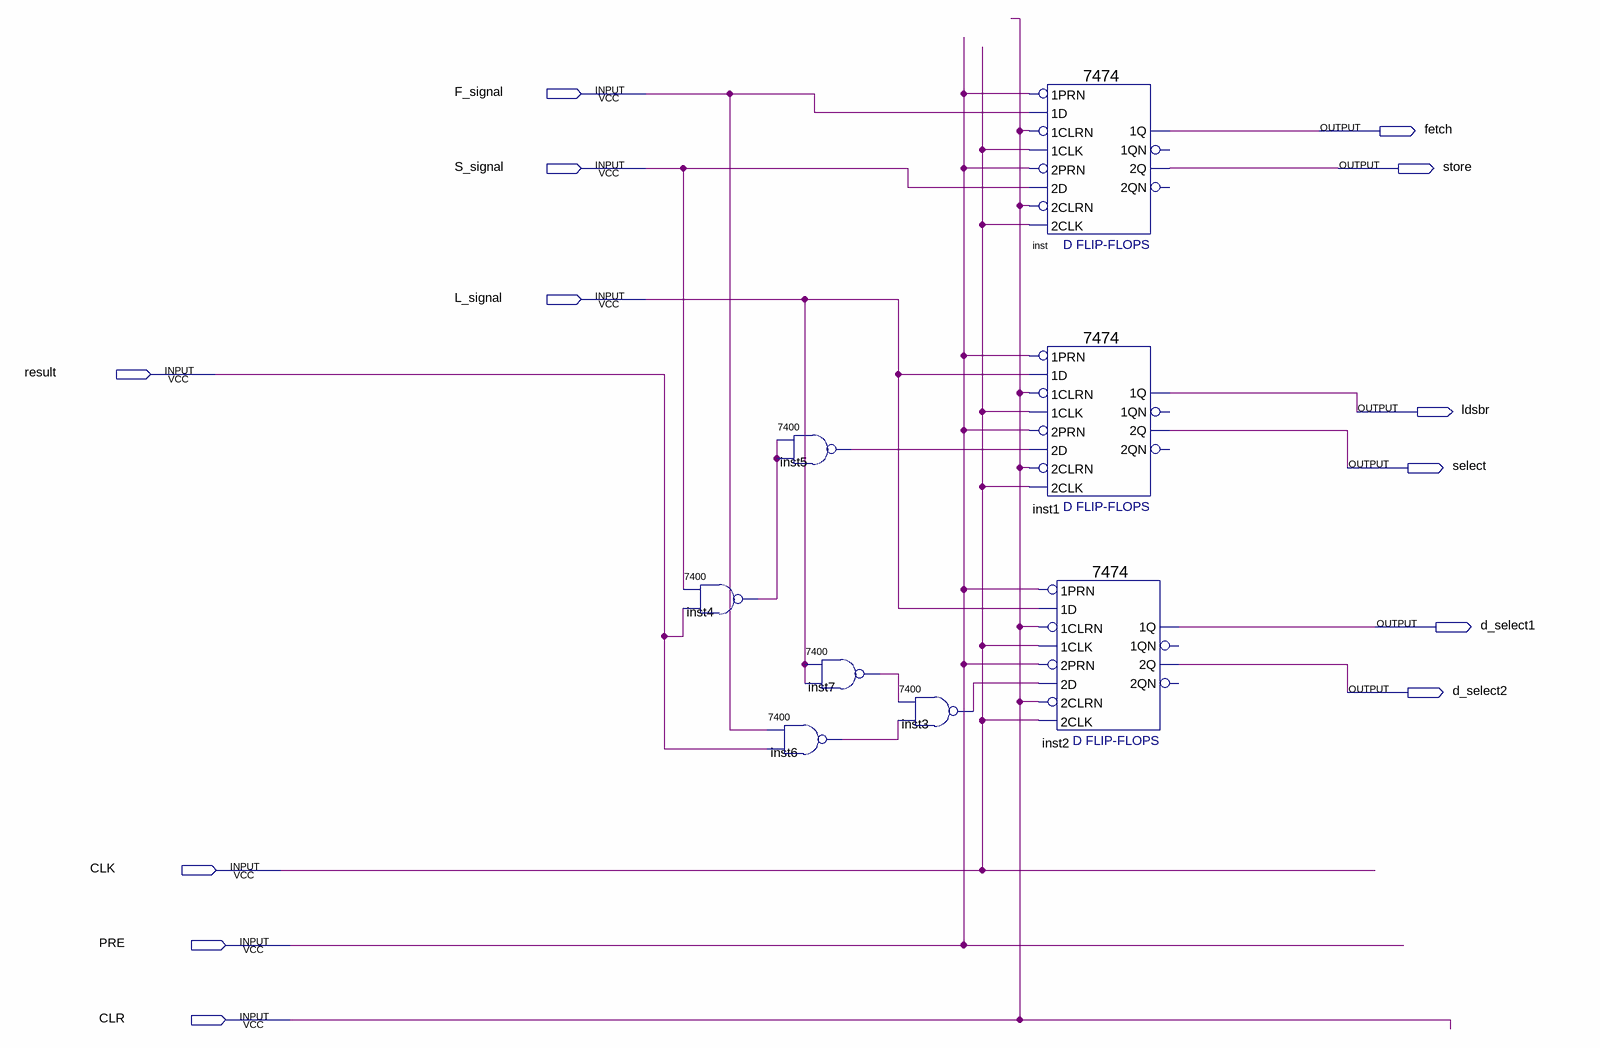
[diagram p0: schematic sheet]
// Quartus schematic Block8.bdf as structural Verilog: 8 symbols, 13 pins
module Block8 (
  input  F_signal,
  input  S_signal,
  input  L_signal,
  input  result,
  input  CLK,
  input  PRE,
  input  CLR,
  output fetch,
  output store,
  output ldsbr,
  output select,
  output d_select1,
  output d_select2
);

  wire inst3_1, inst4_1, inst5_1, inst6_1, inst7_1;

  \7400  inst4 (.\3 (result), .\2 (S_signal), .\1 (inst4_1));
  \7400  inst5 (.\3 (inst4_1), .\2 (inst4_1), .\1 (inst5_1));
  \7400  inst6 (.\3 (result), .\2 (F_signal), .\1 (inst6_1));
  \7400  inst7 (.\3 (L_signal), .\2 (L_signal), .\1 (inst7_1));
  \7400  inst3 (.\3 (inst6_1), .\2 (inst7_1), .\1 (inst3_1));
  \7474  inst (
    .\2D (S_signal), .\2PRN (PRE), .\1CLK (CLK), .\1D (F_signal), .\1PRN (PRE), .\2CLK (CLK), .\2CLRN (CLR),
    .\1CLRN (CLR), .\2Q (store), .\1Q (fetch));  // open: 1QN, 2QN
  \7474  inst1 (
    .\2D (inst5_1), .\2PRN (PRE), .\1CLK (CLK), .\1D (L_signal), .\1PRN (PRE), .\2CLK (CLK), .\2CLRN (CLR),
    .\1CLRN (CLR), .\2Q (select), .\1Q (ldsbr));  // open: 1QN, 2QN
  \7474  inst2 (
    .\2D (inst3_1), .\2PRN (PRE), .\1CLK (CLK), .\1D (L_signal), .\1PRN (PRE), .\2CLK (CLK), .\2CLRN (CLR),
    .\1CLRN (CLR), .\2Q (d_select2), .\1Q (d_select1));  // open: 1QN, 2QN
endmodule
